# EAGLE design smd_board_singlelayer (EAGLE 7.6.0)
CNAME: 3Dator Extensionboard (C) 3Dator GmbH; CREVISION: 0.6; DESIGNER: 3Dator GmbH
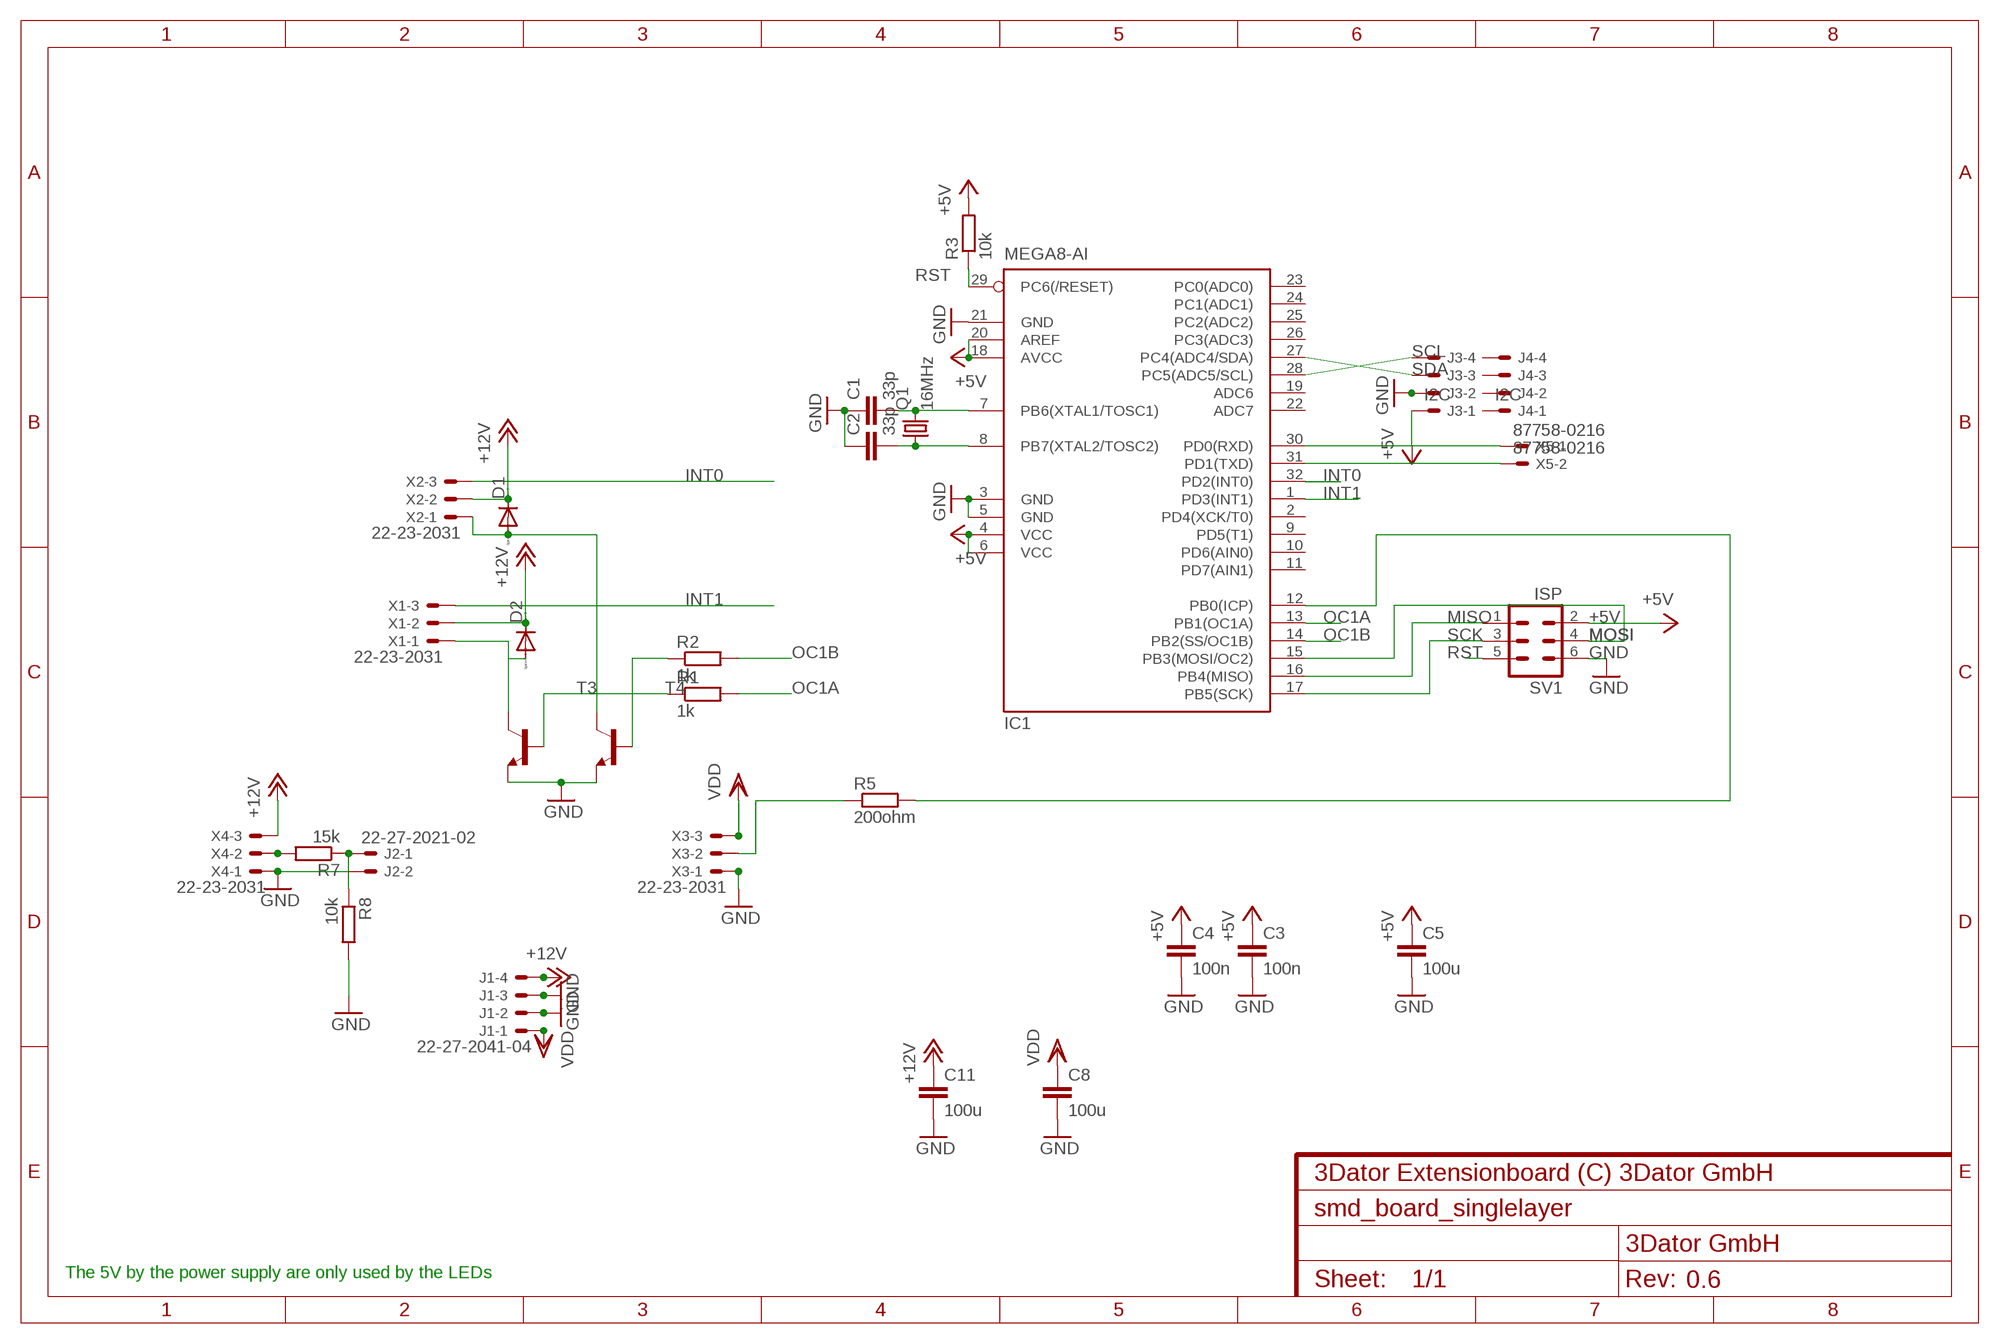
[diagram p0: schematic, sheet 1]

## Parts
C1  33p  C-EUC1206  [C1206]
C2  33p  C-EUC1206  [C1206]
C3  100n  C-EUC1206  [C1206]
C4  100n  C-EUC1206  [C1206]
C5  100u  C-EUC1206  [C1206]
C8  100u  C-EUC1206  [C1206]
C11  100u  C-EUC1206  [C1206]
D1  DIODE-SOD80C  [SOD80C]
D2  DIODE-SOD80C  [SOD80C]
IC1  MEGA8-AI  [TQFP32-08]
J1  22-27-2041-04  [6410-04]
J2  22-27-2021-02  [6410-02]
J3  I2C  22-27-2041-04  [6410-04]
J4  I2C  22-27-2041-04  [6410-04]
Q1  16MHz  CRYSTALHC49UP  [HC49UP]
R1  1k  R-EU_M1206  [M1206]
R2  1k  R-EU_M1206  [M1206]
R3  10k  R-EU_M1206  [M1206]
R5  200ohm  R-EU_M1206  [M1206]
R7  15k  R-EU_M1206  [M1206]
R8  10k  R-EU_M1206  [M1206]
SV1  ISP  ML6  [ML6]
T3  BC808-NPN-SOT23-BEC  [SOT23-BEC]
T4  BC808-NPN-SOT23-BEC  [SOT23-BEC]
X1  22-23-2031  [22-23-2031]
X2  22-23-2031  [22-23-2031]
X3  22-23-2031  [22-23-2031]
X4  22-23-2031  [22-23-2031]
X5  87758-0216  [87758-0216]

## Nets
+5V: C3.1 C4.1 C5.1 IC1.4(VCC) IC1.6(VCC) IC1.18(AVCC) IC1.20(AREF) J3.1 R3.2 SV1.2
+12V: C11.1 D1.C D2.C J1.4 X1.2 X2.2 X4.3
GND: C1.1 C2.1 C3.2 C4.2 C5.2 C8.2 C11.2 IC1.3(GND) IC1.5(GND) IC1.21(GND) J1.2 J1.3 J2.2 J3.2 R8.2 SV1.6 T3.E T4.E X3.1 X4.1
INT0: IC1.32(PD2(INT0)) X2.3
INT1: IC1.1(PD3(INT1)) X1.3
MISO: IC1.16(PB4(MISO)) SV1.1
MOSI: IC1.15(PB3(MOSI/OC2)) SV1.4
N$2: C1.2 IC1.7(PB6(XTAL1/TOSC1)) Q1.2
N$3: D2.A T3.C X1.1
N$4: D1.A T4.C X2.1
N$5: R2.1 T4.B
N$6: R1.1 T3.B
N$7: R5.1 X3.2
N$9: C2.2 IC1.8(PB7(XTAL2/TOSC2)) Q1.1
N$13: IC1.30(PD0(RXD)) X5.1
N$14: R7.2 X4.2
N$15: J2.1 R7.1 R8.1
N$16: IC1.12(PB0(ICP)) R5.2
N$17: IC1.31(PD1(TXD)) X5.2
OC1A: IC1.13(PB1(OC1A)) R1.2
OC1B: IC1.14(PB2(SS/OC1B)) R2.2
RST: IC1.29(PC6(/RESET)) R3.1 SV1.5
SCK: IC1.17(PB5(SCK)) SV1.3
SCL: IC1.28(PC5(ADC5/SCL)) J3.4
SDA: IC1.27(PC4(ADC4/SDA)) J3.3
VDD: C8.1 J1.1 X3.3
Unconnected: IC1.2(PD4(XCK/T0)) IC1.9(PD5(T1)) IC1.10(PD6(AIN0)) IC1.11(PD7(AIN1)) IC1.19(ADC6) IC1.22(ADC7) IC1.23(PC0(ADC0)) IC1.24(PC1(ADC1)) IC1.25(PC2(ADC2)) IC1.26(PC3(ADC3)) J4.1 J4.2 J4.3 J4.4

## Notes on the sheet
- The 5V by the power supply are only used by the LEDs

## Library data of the parts
C1-C5 C8 C11 = rcl:C-EU: CAPACITOR, European symbol
D1 D2 = diode:DIODE-: DIODE
IC1 = atmel:MEGA8: MICROCONTROLLER 8 Kbytes FLASH, 1 kbytes SRAM, 512 bytes EEPROM, USART, 6-channel 10 bit ADC, 2-channel 8 bit ADC Pin compatible with Atmega48, ATMega88, ATMega168 Source: avr.lbr; MPN: ATMEGA8-16AU; OC_FARNELL: 9171371; OC_NEWARK: 73M8863
J1 J3 J4 = con-molex:22-?-04: CONNECTOR wire to board 2.54 mm (.1 inch) pitch header; OC_FARNELL: unknown; OC_NEWARK: unknown
J2 = con-molex:22-?-02: CONNECTOR wire to board 2.54 mm (.1 inch) pitch header; OC_FARNELL: unknown; OC_NEWARK: unknown
Q1 = crystal:CRYSTAL: CRYSTAL; OC_FARNELL: unknown; OC_NEWARK: unknown
R1-R3 R5 R7 R8 = rcl:R-EU_: RESISTOR, European symbol
SV1 = con-ml:ML6: HARTING; OC_FARNELL: unknown; OC_NEWARK: unknown
T3 T4 = transistor:*-NPN-: NPN Transistror BF959 corrected 2008.03.06
X1-X4 = con-molex:22-23-2031: .100" (2.54mm) Center Header - 3 Pin; MF: MOLEX; MPN: 22-23-2031; OC_FARNELL: 1462950; OC_NEWARK: 30C0862
X5 = dual:87758-0216: 2 Pin - 2mm Dual Row Single Wafer, Vertical T/H HDR Source: http://www.molex.com/pdm_docs/sd/877580616_sd.pdf; MPN: 87758-0216; OC_FARNELL: unknown; OC_NEWARK: 94M1513

## Net classes
0 default: clearance 0.205 mm

## Board
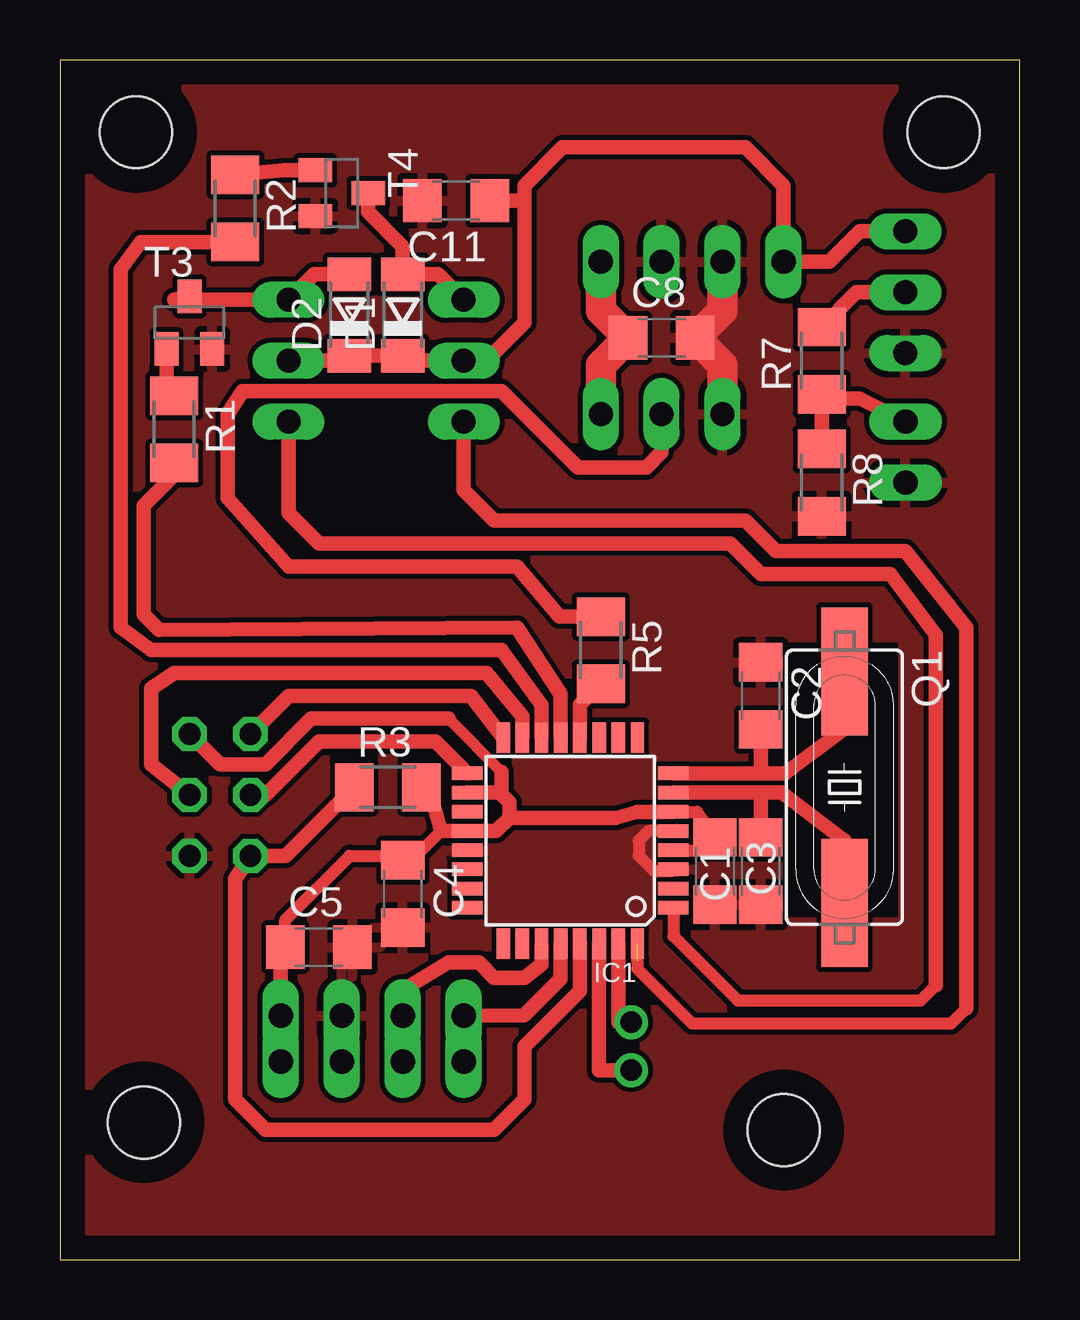
[diagram p1: board, top side]
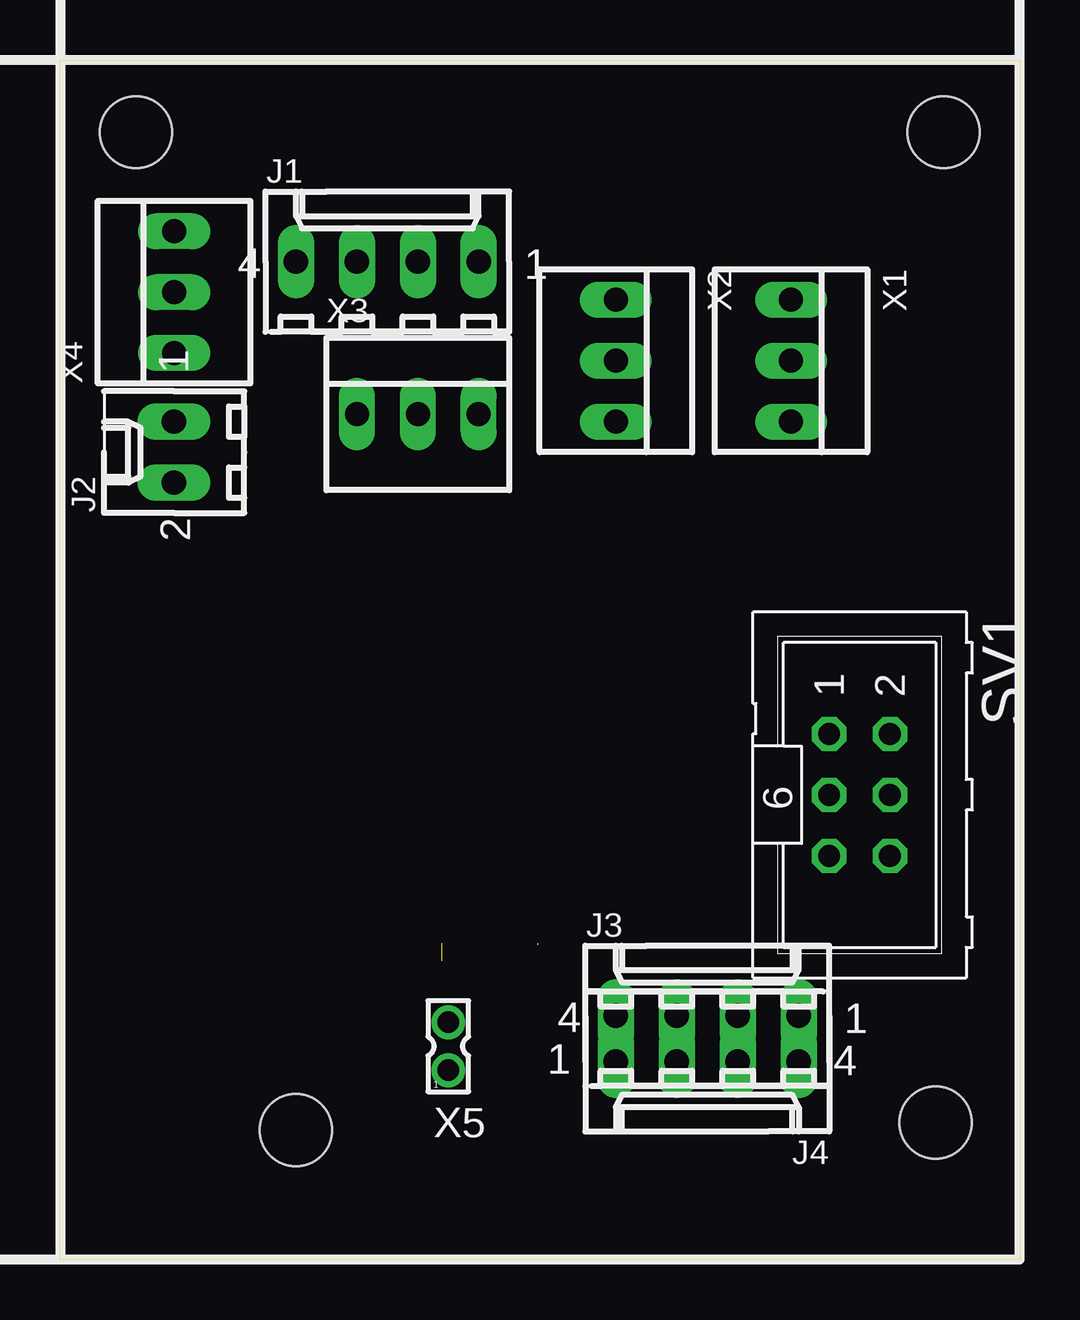
[diagram p2: board, bottom side, seen from below]

Size 40 x 50 mm. Coordinates in mm from the lower left corner, seen from the top.
Outline: 0,0 40,0 40,50 0,50 0,0
Copper layers (1*16): Top 0.035mm / dielectric 1.5mm / Bottom 0.035mm
Design rules "default": minimum track width 10mil, minimum drill 24mil, track to track 8mil, track to pad 8mil, pad to pad 8mil, via to via 8mil, smd to smd 8mil, copper to edge 40mil, drill to drill 8mil, minimum pad ring 10mil, minimum via ring 8mil, stop-mask expansion 4mil, vias tented up to drill 0mil, thermal gap 10mil
Holes 3 mm at 3.49,5.71 36.83,46.99 3.17,46.99 30.16,5.4
tRestrict: area 30.2,14.3 to 34.9,25.7
vRestrict: area 0,0 to 1.3,50.2; area 0,0 to 40,1.3; area 38.7,0 to 40,49.5; area 0,-3.5 to 1.5,-2.9; area 38.5,-3.5 to 40,-2.9; area 17.2,-2.8 to 22.8,-1; area -4.7,0 to -4.1,1.5; area -4.7,48.5 to -4.1,50; area -6.6,22.2 to -4.8,27.8; 6 lines

### Footprints (pad centres in the part's own frame; a part is rotated, then mirrored left to right if it is on the bottom)
C1206 = smd 1.6 x 1.8: 1 -1.4,0; 2 1.4,0
SOD80C = smd 1.4 x 1.8: A 1.7,0; C -1.7,0
TQFP32-08 = smd 1.27 x 0.559: 1 -4.293,2.8; 2 -4.293,2; 3 -4.293,1.2; 4 -4.293,0.4; 5 -4.293,-0.4; 6 -4.293,-1.2; 7 -4.293,-2; 8 -4.293,-2.8; 17 4.293,-2.8; 18 4.293,-2; 19 4.293,-1.2; 20 4.293,-0.4; 21 4.293,0.4; 22 4.293,1.2; 23 4.293,2; 24 4.293,2.8 | smd 0.559 x 1.27: 9 -2.8,-4.293; 10 -2,-4.293; 11 -1.2,-4.293; 12 -0.4,-4.293; 13 0.4,-4.293; 14 1.2,-4.293; 15 2,-4.293; 16 2.8,-4.293; 25 2.8,4.293; 26 2,4.293; 27 1.2,4.293; 28 0.4,4.293; 29 -0.4,4.293; 30 -1.2,4.293; 31 -2,4.293; 32 -2.8,4.293
6410-04 = drill 1.016 long: 1 3.81,0; 2 1.27,0; 3 -1.27,0; 4 -3.81,0
6410-02 = drill 1.016 long: 1 1.27,0; 2 -1.27,0
HC49UP = smd 5.334 x 1.93: 1 -4.826,0; 2 4.826,0
M1206 = smd 1.6 x 2: 1 -1.4,0; 2 1.4,0
ML6 = drill 0.914 octagon: 1 -2.54,-1.27; 2 -2.54,1.27; 3 0,-1.27; 4 0,1.27; 5 2.54,-1.27; 6 2.54,1.27
SOT23-BEC = smd 1 x 1.4: B -0.95,-1.1; C 0,1.1; E 0.95,-1.1
22-23-2031 = drill 1 long: 1 -2.54,0; 2 0,0; 3 2.54,0
87758-0216 = drill 0.9 pad 1.27: 1 0,-1; 2 0,1

### Placement (x,y rotation side)
C1  29.21,16.19 90 top
C2  29.21,23.5 270 top
C3  27.3,16.19 270 top
C4  14.29,15.24 270 top
C5  10.79,13.02 0 top
C8  25.08,38.42 0 top
C11  16.51,44.13 180 top
D1  14.29,39.37 90 top
D2  12.06,39.37 90 top
IC1  21.27,17.46 180 top
J1  26.35,41.59 0 bottom
J2  35.24,33.66 90 bottom
J3  13.02,10.16 0 bottom
J4  13.02,8.26 180 bottom
Q1  32.7,19.68 270 top
R1  4.76,34.61 270 top
R2  7.3,43.81 270 top
R3  13.67,19.68 0 top
R5  22.54,25.4 270 top
R7  31.75,37.47 90 top
R8  31.75,32.38 270 top
SV1  6.67,19.37 270 bottom
T3  5.4,39.05 0 top
T4  11.75,44.45 270 top
X1  9.53,37.47 270 bottom
X2  16.83,37.47 270 bottom
X3  25.08,35.24 0 bottom
X4  35.24,40.32 90 bottom
X5  23.81,8.89 0 bottom

### Tracks (layer width: path | path; a pad name or v marks a point on that pad's centre or on a via)
+5V
  Top 0.457: 16.19,22.54 18.41,20.32
  Top 0.508: C5.1 9.39,14.16 12.06,16.83 14.1,16.83 C4.1 14.65,16.64 15.88,17.86 | IC1.6 26.55,18.66 C3.1 26.46,17.06 IC1.4
  Top 0.61: J3.1 9.21,12.25 C5.1 | IC1.18 18.32,19.46 | 18.32,19.46 18.73,19.05 18.73,18.41 | 18.73,18.41 18.18,17.86 IC1.20 15.88,17.86 15.7,18.54 15.56,19.05 R3.2 | 18.73,18.41 23.18,18.41 24.06,18.66 IC1.6 | SV1.2 6.67,20.64 8.57,20.64 10.48,22.54 16.19,22.54 | 18.41,20.32 18.41,19.56 18.32,19.46
+12V
  Top 0.61: 19.37,44.13 19.37,44.77 20.95,46.35 28.57,46.35 30.16,44.77 J1.4 32.07,41.59 33.34,42.86 X4.3 | 19.37,44.13 19.37,39.05 17.78,37.47 X2.2 14.49,37.47 D1.C D2.C 11.86,37.47 X1.2 | C11.1 19.37,44.13
GND
  Top 0.508: IC1.5 24.53,17.86 24.13,17.46 24.13,16.83 24.77,16.19 25.5,16.19 IC1.3
  Top 1.27: J1.3 27.62,39.56 C8.2 27.62,37.28 X3.1
  pour Top: 0.95,0.64 1.03,49.24 39.13,49.24 39.05,0.95
INT0  (1 unrouted)
  Top 0.508: 24.07,12.44 24.07,12.12 26.35,9.84 37.15,9.84 37.78,10.48
  Top 0.61: 37.78,10.48 37.78,26.35 35.24,29.53 29.84,29.53 28.57,30.8 18.1,30.8 16.83,32.07 X2.3
INT1
  Top 0.508: IC1.1 25.57,13.49 28.26,10.79 35.88,10.79 36.51,11.43
  Top 0.61: 36.51,11.43 36.51,26.04 34.61,28.57 29.21,28.57 27.94,29.84 10.79,29.84 9.53,31.11 X1.3
MISO
  Top 0.61: IC1.16 17.14,23.5 9.53,23.5 SV1.1
MOSI
  Top 0.61: SV1.4 3.81,20.64 3.81,23.81 4.76,24.45 17.78,24.45 19.27,22.64 IC1.15
N$2
  Top 0.61: IC1.7 29.21,19.46 | 29.21,19.46 30.07,19.46 32.7,17.46 Q1.2 | C1.2 29.21,19.46
N$3
  Top 0.61: T3.C 4.76,40.01 X1.1 10.59,41.07 D2.A
N$4
  Top 0.61: X2.1 15.76,41.07 D1.A 14.29,42.23 12.85,43.67 T4.C
N$5
  Top 0.61: T4.B 9.34,45.4 R2.1
N$6
  Top 0.61: T3.B 4.45,36.32 R1.1
N$7
  Top 0.61: R5.1 20.82,26.8 19.05,28.89 9.53,28.89 6.99,31.75 6.99,35.24 7.62,36.2 18.41,36.2 21.59,33.02 24.45,33.02 25.08,33.66 X3.2
N$9
  Top 0.406: 32.38,24.13 Q1.1
  Top 0.61: Q1.1 32.7,22.12 30.21,20.26 29.21,20.26 | IC1.8 29.21,20.26 | C2.2 29.21,20.26
N$13
  Top 0.61: X5.1 22.47,7.89 IC1.30
N$14
  Top 0.61: R7.2 33.21,40.32 X4.2
N$15
  Top 0.61: 31.75,35.88 R8.1 | J2.1 33.34,35.88 31.75,35.88 | 31.75,35.88 R7.1
N$16
  Top 0.61: IC1.12 21.67,23.13 R5.2
N$17
  Top 0.61: X5.2 23.27,9.89 IC1.31
OC1A
  Top 0.61: IC1.13 20.87,23.58 19.05,26.35 4.13,26.25 3.49,26.88 3.49,31.43 4.76,32.7 R1.2
OC1B
  Top 0.61: IC1.14 20.07,23.11 18.41,25.4 3.81,25.4 2.54,26.35 2.54,41.27 3.36,42.41 R2.2
RST
  Top 0.406: R3.1 11.95,19.25
  Top 0.61: IC1.29 21.67,11.2 19.37,8.89 19.37,6.67 18.1,5.4 8.57,5.4 7.3,6.67 7.3,15.88 SV1.5 9.41,16.83 R3.1
SCK
  Top 0.406: IC1.17 16.89,20.26
  Top 0.61: SV1.3 8.57,19.37 10.79,21.59 15.65,21.59 IC1.17
SCL
  Top 0.61: J3.4 19.35,10.18 20.87,11.71 20.87,13.03 IC1.28
SDA  (1 unrouted)
  Top 0.61: 20.06,13.11 20.06,12.3 19.37,11.75 18.1,11.75 17.46,12.38 16.19,12.38 14.24,11.19 14.24,10.21 J3.3
VDD
  Top 1.27: X3.3 22.54,37.28 C8.1 22.54,39.56 J1.1